# Altium project NIC Dataloger.PrjPcb
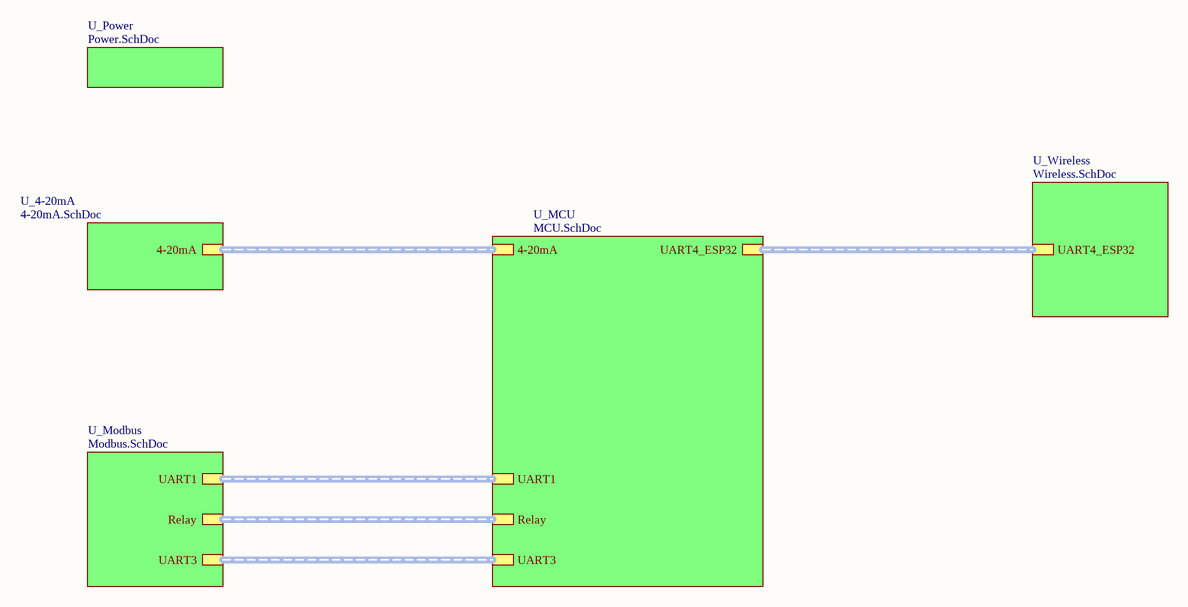
[diagram p0: Diagram.SchDoc]

6 sheets, 151 parts. Net scope: hierarchical (ports join the sheet entries above them; power ports are global).
Board file: Let's Connect.PcbDoc
Sheets:
  Diagram.SchDoc
    U_Modbus = Modbus.SchDoc
    U_Wireless = Wireless.SchDoc
    U_Power = Power.SchDoc
    U_MCU = MCU.SchDoc
    U_4-20mA = 4-20mA.SchDoc

## Sheet Diagram.SchDoc
size A4; SheetNumber: 1; SheetTotal: 8

### Sub-sheets
U_4-20mA = 4-20mA.SchDoc: 4-20mA (harness 4-20mA)
U_MCU = MCU.SchDoc: UART1 (harness UART1), UART3 (harness UART3), Relay (harness Relay), UART4_ESP32 (harness UART4_ESP32), 4-20mA (harness 4-20mA)
U_Modbus = Modbus.SchDoc: UART1 (harness UART1), UART3 (harness UART3), Relay (harness Relay)
U_Power = Power.SchDoc: no entries
U_Wireless = Wireless.SchDoc: UART4_ESP32 (harness UART4_ESP32)

### Buses and harness runs
harness sheet U_4-20mA/4-20mA = sheet U_MCU/4-20mA
harness sheet U_MCU/Relay = sheet U_Modbus/Relay
harness sheet U_MCU/UART1 = sheet U_Modbus/UART1
harness sheet U_MCU/UART3 = sheet U_Modbus/UART3
harness sheet U_MCU/UART4_ESP32 = sheet U_Wireless/UART4_ESP32

### Notes on the sheet
- Title
- Size:
- Date:
- A3
- Number:
- Time:
- Revision:
- Sheet
- of
- NICHIETSUVN.COM <http://NICHIETSUVN.COM>
- R&D
- File:

## Sheet Modbus.SchDoc
size A4; SheetNumber: 4; SheetTotal: 6
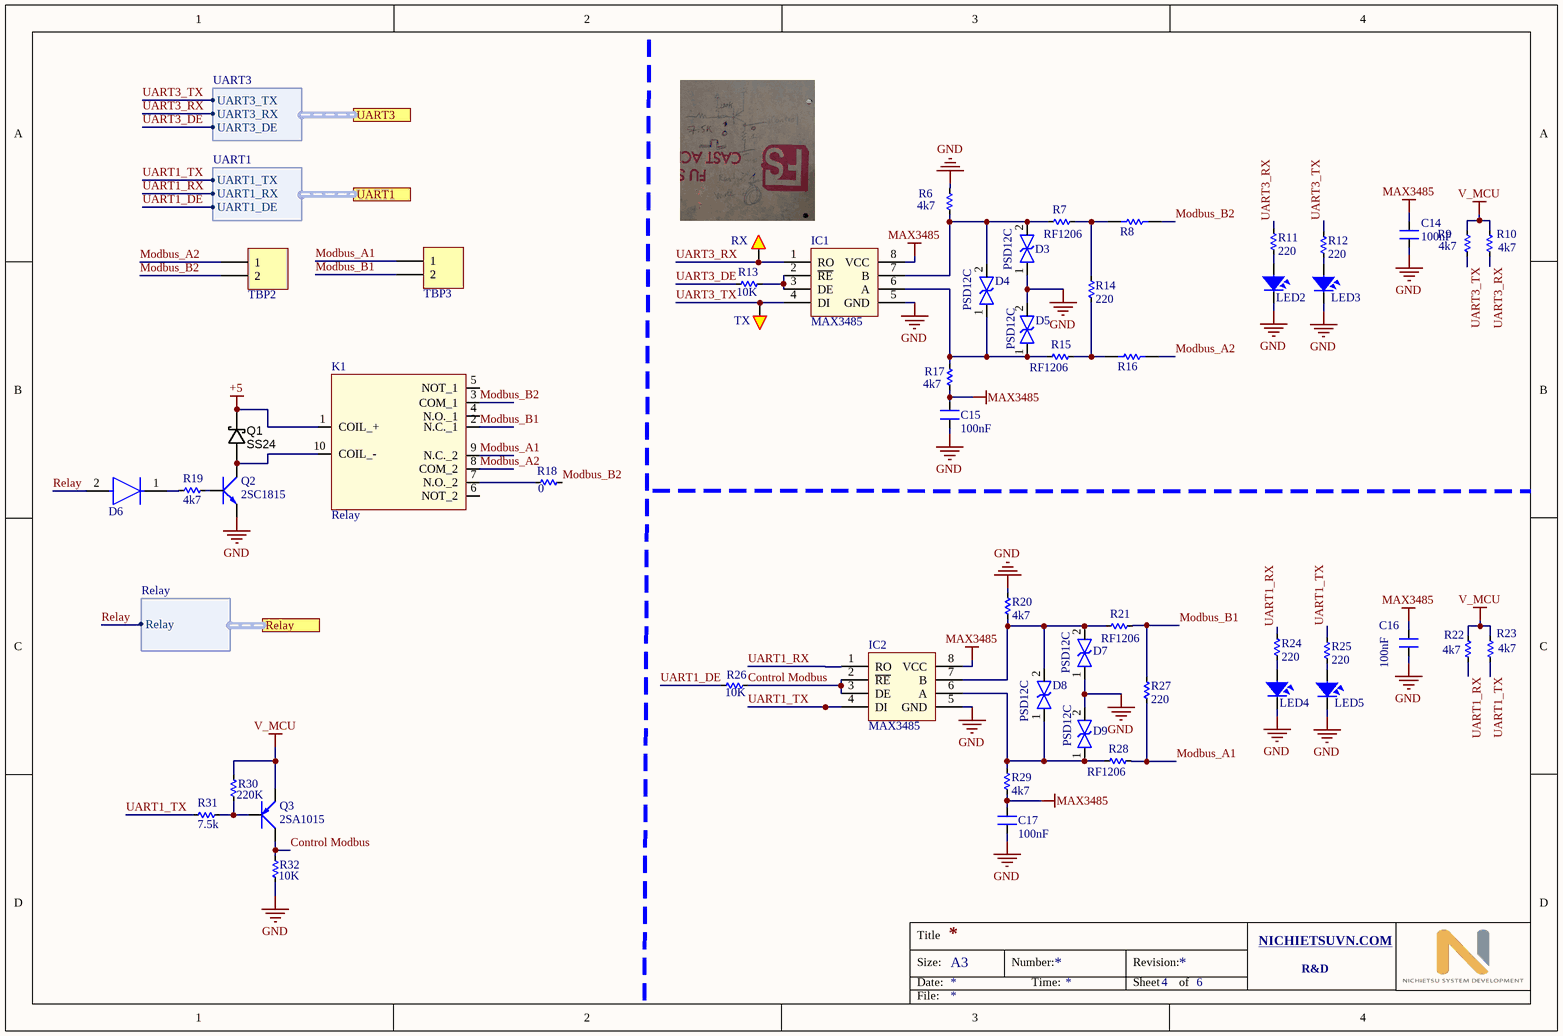
[diagram p1: Modbus.SchDoc]

### Parts
B1  RX  [SMD_1.5]
B2  TX  [SMD_1.5]
C14  100nF  [CN-SMD-0603]
C15  100nF  [CN-SMD-0603]
C16  100nF  [CN-SMD-0603]
C17  100nF  [CN-SMD-0603]
D3  PSD12C  [PSD12C]
D4  PSD12C  [PSD12C]
D5  PSD12C  [PSD12C]
D6  1N4148W-HE3-08  [1N4148]  (value not drawn)
D7  PSD12C  [PSD12C]
D8  PSD12C  [PSD12C]
D9  PSD12C  [PSD12C]
IC1  MAX3485  [SO8]
IC2  MAX3485  [SO8]
K1  Relay  [Relay EA2]
LED2  LED  [LED-0805-Blue]  (value not drawn)
LED3  LED  [LED-0805-Blue]  (value not drawn)
LED4  LED  [LED-0805-Blue]  (value not drawn)
LED5  LED  [LED-0805-Blue]  (value not drawn)
Q1  SS24  [DO-214AC]
Q2  2SC1815  [SOT23-321]
Q3  2SA1015  [SOT23-321]
R6  4k7  [RES-SMD-0603]
R7  RF1206  [RES-SMD-1206]
R8  0R/R0603  [R0603]  (value not drawn)
R9  4k7  [RES-SMD-0603]
R10  4k7  [RES-SMD-0603]
R11  220  [RES-SMD-0603]
R12  220  [RES-SMD-0603]
R13  10K  [RES-SMD-0603]
R14  220  [RES-SMD-0603]
R15  RF1206  [RES-SMD-1206]
R16  0R/R0603  [R0603]  (value not drawn)
R17  4k7  [RES-SMD-0603]
R18  0  [RES-SMD-0603]
R19  4k7  [RES-SMD-0603]
R20  4k7  [RES-SMD-0603]
R21  RF1206  [RES-SMD-1206]
R22  4k7  [RES-SMD-0603]
R23  4k7  [RES-SMD-0603]
R24  220  [RES-SMD-0603]
R25  220  [RES-SMD-0603]
R26  10K  [RES-SMD-0603]
R27  220  [RES-SMD-0603]
R28  RF1206  [RES-SMD-1206]
R29  4k7  [RES-SMD-0603]
R30  220K  [RES-SMD-0603]
R31  7.5k  [RES-SMD-0603]
R32  10K  [RES-SMD-0603]
TBP2  WE-Terminal Blocks Plugable Type 691322310002  [Terminal_Blocks_Pluggable_Socket__Right_Angle__3.81_mm_Pitch__2_Position]  (value not drawn)
TBP3  WE-Terminal Blocks Plugable Type 691322310002  [Terminal_Blocks_Pluggable_Socket__Right_Angle__3.81_mm_Pitch__2_Position]  (value not drawn)

### Ports
Relay (harness Relay), UART1 (harness UART1), UART3 (harness UART3)

### Harnesses
UART1: UART1_TX, UART1_RX, UART1_DE
UART3: UART3_TX, UART3_RX, UART3_DE
Relay: Relay

### Nets
+5: K1.1(COIL_+) Q1.C
GND: C14.1 C15.2 C16.1 C17.2 D3.1 D5.2 D7.1 D9.2 IC1.5(GND) IC2.5(GND) LED2.2 LED3.2 LED4.2 LED5.2 Q2.1(E) R6.1 R20.1 R32.1
MAX3485: C14.2 C15.1 C16.2 C17.1 IC1.8(VCC) IC2.8(VCC) R17.1 R29.1
V_MCU: Q3.1(E) R9.1 R10.1 R22.1 R23.1 R30.2
Control Modbus: IC2.2(~{RE}) IC2.3(DE) Q3.2(C) R26.2 R32.2
Modbus_A1: K1.9(N.C._2) R27.2 R28.1 TBP3.1
Modbus_A2: K1.8(COM_2) R16.2 TBP2.1
Modbus_B1: K1.2(N.C._1) R21.1 R27.1 TBP3.2
Modbus_B2: K1.3(COM_1) R8.2 R18.2 TBP2.2
Relay: D6.2(A) ; port Relay.Relay
UART1_DE: R26.1 ; port UART1.UART1_DE
UART1_RX: IC2.1(RO) R22.2 R24.1 ; port UART1.UART1_RX
UART1_TX: IC2.4(DI) R23.2 R25.1 R31.1 ; port UART1.UART1_TX
UART3_DE: R13.1 ; port UART3.UART3_DE
UART3_RX: B1.1 IC1.1(RO) R10.2 R11.1 ; port UART3.UART3_RX
UART3_TX: B2.1 IC1.4(DI) R9.2 R12.1 ; port UART3.UART3_TX
NetD3_2: D3.2 D4.2 IC1.7(B) R6.2 R7.2
NetD4_1: D4.1 D5.1 IC1.6(A) R15.2 R17.2
NetD6_1: D6.1(C) R19.2
NetD7_2: D7.2 D8.2 IC2.7(B) R20.2 R21.2
NetD8_1: D8.1 D9.1 IC2.6(A) R28.2 R29.2
NetIC1_2: IC1.2(~{RE}) IC1.3(DE) R13.2
NetK1_7: K1.7(N.O._2) R18.1
NetK1_10: K1.10(COIL_-) Q1.A Q2.2(C)
NetLED2_1: LED2.1 R11.2
NetLED3_1: LED3.1 R12.2
NetLED4_1: LED4.1 R24.2
NetLED5_1: LED5.1 R25.2
NetQ2_3: Q2.3(B) R19.1
NetQ3_3: Q3.3(B) R30.1 R31.2
NetR7_1: R7.1 R8.1 R14.1
NetR14_2: R14.2 R15.1 R16.1

Not connected (* = marked no-connect by the designer): K1 4(N.O._1) 5(NOT_1) 6(NOT_2)

### Notes on the sheet
- Title
- Size:
- Date:
- A3
- Number:
- Time:
- Revision:
- Sheet
- of
- NICHIETSUVN.COM <http://NICHIETSUVN.COM>
- R&D
- File:

### Library data of the parts
B1 B2 = Test: WR-PHD 2.54 mm Angled Socket Header; Manufacturer: W¨¹rth Elektronik eiSos GmbH; partNo: 613002143121; ComponentLink1 Description: Manufacturer; ComponentLink2 Description: Datasheet; NoPins: 02; Created Date: 29 March 2013; ComponentLink1URL: http://www.we-online.com; ComponentLink2URL: http://katalog.we-online.de/em/datasheet/6130xx143121.pdf; Created by: Karrer Zheng
C14-C17 = CN: Value: 33pF
D3-D5 D7-D9 = PSD12C: diode tvs
IC1 IC2 = MAX485: RS232 - RS485 (Same sn75176)
K1 = EA2-5NU: Relay or Contactor; Manufacturer_Name: Kemet; Datasheet Link: https://api.kemet.com/component-edge/download/datasheet/EA2-5NU.pdf; Height: 5.4mm; Manufacturer_Part_Number: EA2-5NU
LED2-LED5 = LED SMD: Value: LED 3 - 5 ly 2 Colour
Q1 = DIODE_SS24: Diode Schottky 40V 2A Surface Mount DO-214AC (SMA); Manufacturer 1: Comchip Technology; Manufacturer Part Number 1: SS24-HF; Speed: Fast Recovery =< 500ns, > 200mA (Io); Ratings: 40V; 2A; Pcs 2: 1; Parameter 1Voltage - Forward (Vf) (Max) @ If: 550mV @ 2A; Package / Case: DO-214AC, SMA; Diode Type: Schottky; Mounting Type: Surface Mount; Supplier 1: Digi-Key; Supplier Part Number 1: 641-SS24-HFDKR-ND; Supplier 2: https://www.thegioiic.com; Supplier Part Number 2: https://www.thegioiic.com/products/ss24-sma; Price 2: 800
Q2 = 2SC1815: NPN 600mW, ECB; Value: C1815
Q3 = 2SA1015: PNP 600mW, ECB; Value: A1015
R6 R7 R9-R15 R17-R32 = Res-SMD: Resistor; Manufacturer: Generic Components; Class: Passive; Published: 08/06/2000; Publisher: Altium Hobart Technology Centre
R8 R16 = RES_0R_R0603: RES SMD 0.0OHM JUMPER 1/10W 0603; Manufacturer: Yageo; Manufacturer Part Number: RC0603JR-070RL; Resistance (Ohms): 0.0; Power (Watts): 0.1W, 1/10W; RoHS: RoHS Compliant; Category: Resistors; Packaging: Tape & Reel (TR); Tolerance: Jumper; Composition: Thick Film; Features: Moisture Resistant; Temperature Coefficient: -; Operating Temperature: -55°C ~ 155°C; Package / Case: 0603 (1608 Metric); Supplier Device Package: 0603; Size / Dimension: 0.063" L x 0.031" W (1.60mm x 0.80mm); Height: 0.022" (0.55mm); Number of Terminations: 2; ComponentLink1URL: http://www.yageo.com/documents/recent/PYu-RC_Group_51_RoHS_L_04.pdf; ComponentLink1Description: http://www.yageo.com/documents/recent/PYu-RC_Group_51_RoHS_L_04.pdf; Supplier 1: Digi-Key; Supplier Part Number 1: 311-0.0GRCT-ND
TBP2 TBP3 = Terminal_Blocks_Pluggable_Socket__Right_Angle__3.81_mm_Pitch__2_Position: WR-TBL Terminal block - serie 322 - 3.81 mm; Manufacturer 1: W¨¹rth Elektronik eiSos GmbH; ComponentLink1 Description: Manufacturer; ComponentLink2 Description: Datasheet; NoPins: 02; Pcs 2: 1; ComponentLink1URL: http://www.we-online.com; ComponentLink2URL: http://katalog.we-online.de/em/datasheet/6913223100xx.pdf; Supplier 1: Digi-Key; Supplier Part Number 1: *; Supplier 2: https://www.thegioiic.com; Manufacturer Part Number 1: 691322310002; Supplier Part Number 2: https://www.thegioiic.com/products/kf-3-81-2-r-terminal-block-plug-in-han-pcb-2-chan-cong-3-81mm; Price 2: 2000

## Sheet Wireless.SchDoc
size A4; SheetNumber: 6; SheetTotal: 6
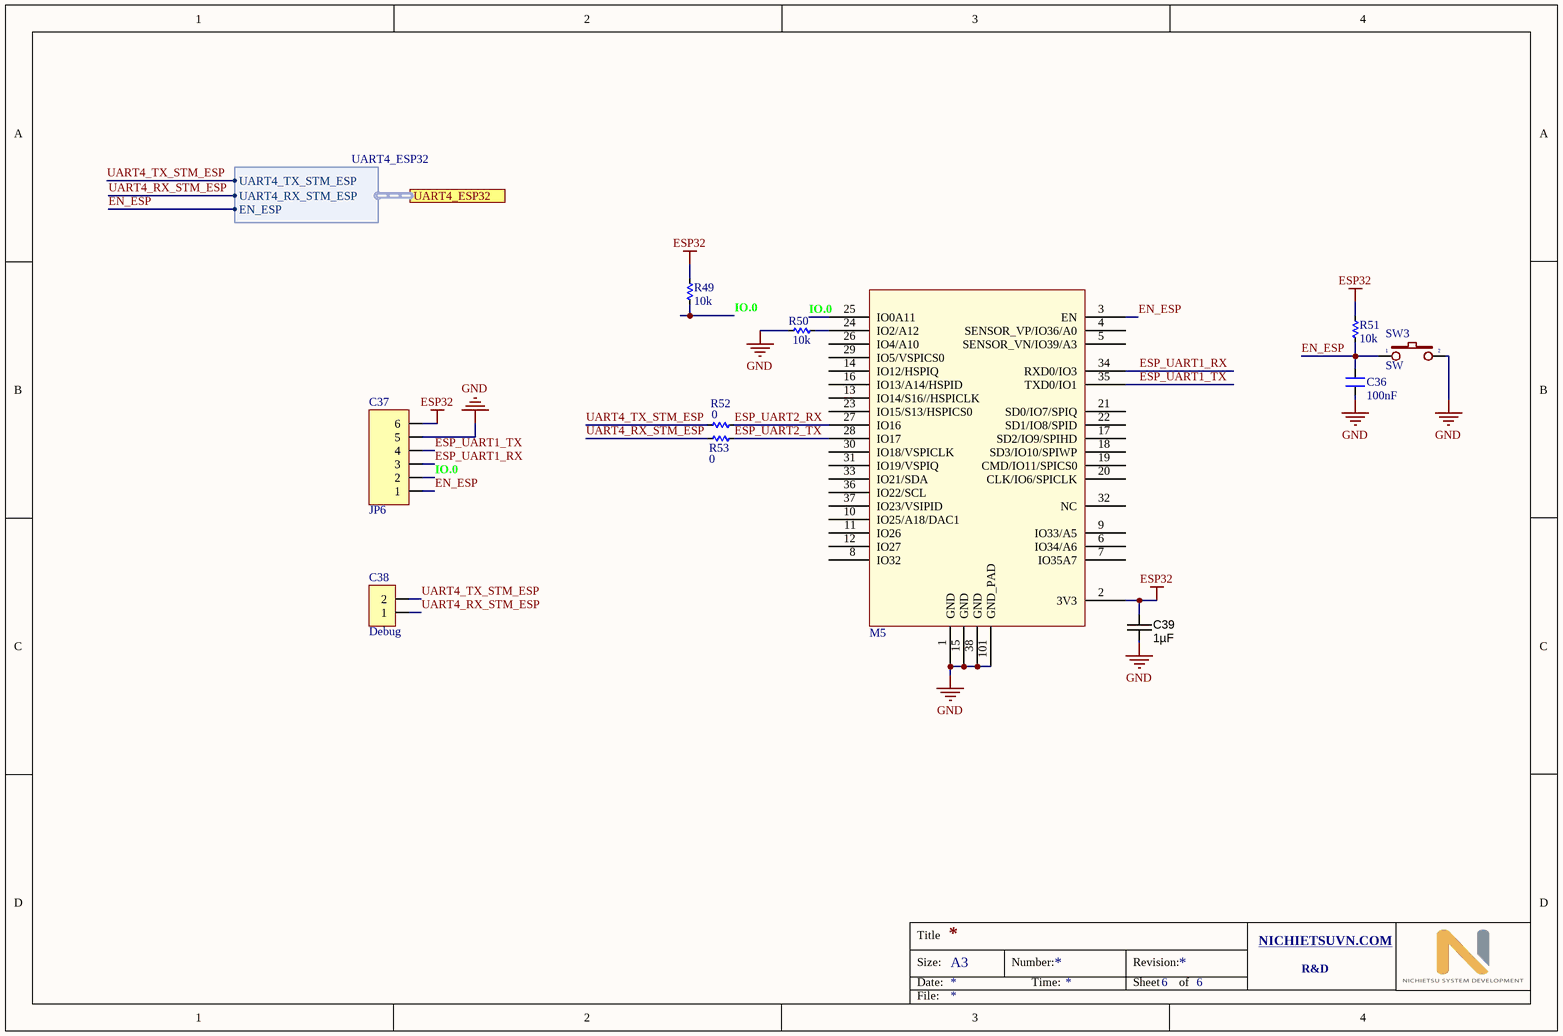
[diagram p2: Wireless.SchDoc]

### Parts
C36  100nF  [CN-SMD-0603]
C37  JP6  [JP6-D1T]
C38  Debug  [JP2-CLOSED]
C39  1µF  [CAPC1608X90N]
M5  ESP32S_Module  [ESP32S]  (value not drawn)
R49  10k  [RES-SMD-0603]
R50  10k  [RES-SMD-0603]
R51  10k  [RES-SMD-0603]
R52  0  [RES-SMD-0603]
R53  0  [RES-SMD-0603]
SW3  SW  [SW1-SMD]

### Ports
UART4_ESP32 (harness UART4_ESP32)

### Harnesses
UART4_ESP32: UART4_TX_STM_ESP, UART4_RX_STM_ESP, EN_ESP

### Nets
ESP32: C37.6 C39.1 M5.2(3V3) R49.1 R51.1
GND: C36.2 C37.5 C39.2 M5.1(GND) M5.15(GND) M5.38(GND) M5.101(GND_PAD) R50.1 SW3.2
EN_ESP: C36.1 C37.1 M5.3(EN) R51.2 SW3.1 ; port UART4_ESP32.EN_ESP
ESP_UART1_RX: C37.3 M5.34(RXD0/IO3)
ESP_UART1_TX: C37.4 M5.35(TXD0/IO1)
ESP_UART2_RX: M5.27(IO16) R52.1
ESP_UART2_TX: M5.28(IO17) R53.1
IO.0: C37.2 M5.25(IO0A11) R49.2
UART4_RX_STM_ESP: C38.1 R53.2 ; port UART4_ESP32.UART4_RX_STM_ESP
UART4_TX_STM_ESP: C38.2 R52.2 ; port UART4_ESP32.UART4_TX_STM_ESP
NetM5_24: M5.24(IO2/A12) R50.2

Not connected (* = marked no-connect by the designer): M5 4(SENSOR_VP/IO36/A0) 5(SENSOR_VN/IO39/A3) 6(IO34/A6) 7(IO35A7) 8(IO32) 9(IO33/A5) 10(IO25/A18/DAC1) 11(IO26) 12(IO27) 13(IO14/S16//HSPICLK) 14(IO12/HSPIQ) 16(IO13/A14/HSPID) 17(SD2/IO9/SPIHD) 18(SD3/IO10/SPIWP) 19(CMD/IO11/SPICS0) 20(CLK/IO6/SPICLK) 21(SD0/IO7/SPIQ) 22(SD1/IO8/SPID) 23(IO15/S13/HSPICS0) 26(IO4/A10) 29(IO5/VSPICS0) 30(IO18/VSPICLK) 31(IO19/VSPIQ) 32(NC) 33(IO21/SDA) 36(IO22/SCL) 37(IO23/VSIPID)

### Notes on the sheet
- Title
- Size:
- Date:
- A3
- Number:
- Time:
- Revision:
- Sheet
- of
- NICHIETSUVN.COM <http://NICHIETSUVN.COM>
- R&D
- File:

### Library data of the parts
C36 = CN: Value: 33pF
C37 = JP6: WR-PHD 2.54 mm Angled Socket Header; Manufacturer: W¨¹rth Elektronik eiSos GmbH; partNo: 613006143121; ComponentLink1 Description: Manufacturer; ComponentLink2 Description: Datasheet; NoPins: 06; Created Date: 29 March 2013; ComponentLink1URL: http://www.we-online.com; ComponentLink2URL: http://katalog.we-online.de/em/datasheet/6130xx143121.pdf; Created by: Karrer Zheng
C38 = JP2: WR-PHD 2.54 mm Angled Socket Header; Manufacturer: W¨¹rth Elektronik eiSos GmbH; partNo: 613002143121; ComponentLink1 Description: Manufacturer; ComponentLink2 Description: Datasheet; NoPins: 02; Created Date: 29 March 2013; ComponentLink1URL: http://www.we-online.com; ComponentLink2URL: http://katalog.we-online.de/em/datasheet/6130xx143121.pdf; Created by: Karrer Zheng
C39 = CAPC_1uF_0603_X7R_35V_10%: 1µF ±10% 16V Ceramic Capacitor X7R 0603 (1608 Metric); Manufacturer 1: Taiyo Yuden; Manufacturer Part Number 1: GMK107AB7105KAHT; Voltage - Rated: 35V; Pcs 2: 10; Tolerance: ±10%; Operating Temperature: -55°C ~ 125°C; Package / Case: 0603 (1608 Metric); Temperature Coefficient: X7R; Ratings: AEC-Q200; Applications: Automotive; Packaging: Digi-Reel®; Supplier 1: Digi-Key; Supplier Part Number 1: 587-3352-6-ND; Supplier 2: http://www.tme.vn; Supplier Part Number 2: http://www.tme.vn/Product.aspx?id=728#page=pro_info; Price 2: 1800; Value: 1µF
M5 = ESP32S_Module: Esp-32S; Datasheet: https://espressif.com/sites/default/files/documentation/esp_wroom_32_datasheet_en.pdf
R49-R53 = Res-SMD: as R6 on sheet Modbus; Published: 08/06/2000; Publisher: Altium Hobart Technology Centre
SW3 = SW2: Switch button 2 pin; Value: SW chip 2 pin

## Sheet Power.SchDoc
size A4; SheetNumber: 2; SheetTotal: 6
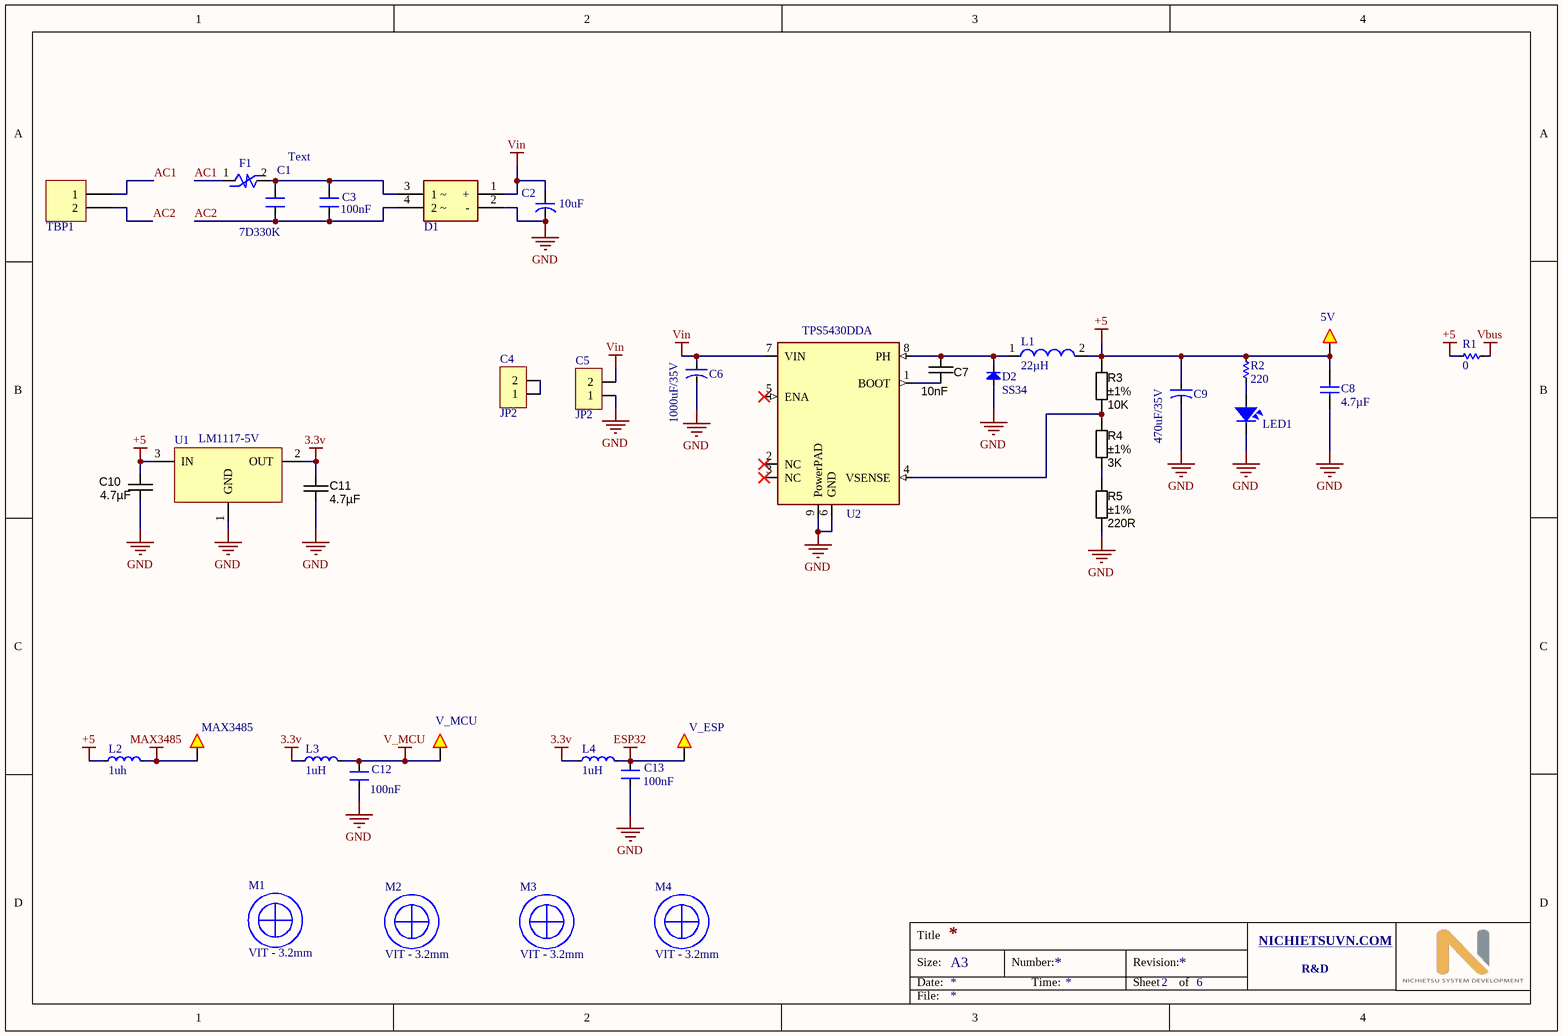
[diagram p3: Power.SchDoc]

### Parts
C1  7D330K  [CN2-G]
C2  10uF  [CN-SMD-0805]
C3  100nF  [CN1]
C4  JP2  [JP2-C1T]
C5  JP2  [JP2-C1T]
C6  1000uF/35V  [CA-ALU-5W]
C7  10nF  [CAPC1608X90N]
C8  4.7µF  [CAPC1608X06L]
C9  470uF/35V  [CA-ALU-5W]
C10  4.7µF  [CAPC2012X135N]
C11  4.7µF  [CAPC2012X135N]
C12  100nF  [CN-SMD-0603]
C13  100nF  [CN-SMD-0805]
Check1  5V  [SMD-2]
D1  MB6S  [MB6]  (value not drawn)
D2  SS34  [DIO-SMD-106]
F1  RUEF185  [RES-1WD]  (value not drawn)
L1  22µH  [IND_COIL_8D43]
L2  1uh  [INDC1608X06L]
L3  1uH  [INDC1608X06L]
L4  1uH  [INDC1608X06L]
LED1  LED  [LED-0805-Blue]  (value not drawn)
M1  VIT - 3.2mm  [VIT - 3.2MM_2]
M2  VIT - 3.2mm  [VIT - 3.2MM_2]
M3  VIT - 3.2mm  [VIT - 3.2MM_2]
M4  VIT - 3.2mm  [VIT - 3.2MM_2]
R1  0  [RES-SMD-0603]
R2  220  [RES-SMD-0603]
R3  value 10K  Tolerance: ±1%  [RESC1608X55N]  (hidden comment: 10K_0603_1%)
R4  value 3K  Tolerance: ±1%  [RESC1608X55N]  (hidden comment: 3K_0603_0.5%)
R5  value 220R  Tolerance: ±1%  [RESC1608X55N]  (hidden comment: 220R_0603_1%)
TBP1  WE-Terminal Blocks Plugable Type 691322310002  [Terminal_Blocks_Pluggable_Socket__Right_Angle__3.81_mm_Pitch__2_Position]  (value not drawn)
U1  LM1117-5V  [SOT223]
U2  TPS5430DDA  [TPS5430]
V1  MAX3485  [SMD_1]
V2  V_MCU  [SMD_1]
V3  V_ESP  [SMD_1]

### Nets
3.3v: C11.2 L3.1 L4.1 U1.2(OUT)
+5: C8.2 C9.1 C10.2 Check1.1 L1.2 L2.1 R1.1 R2.1 R3.2 U1.3(IN)
ESP32: C13.1 L4.2 V3.1
GND: C2.2 C5.1 C6.2 C8.1 C9.2 C10.1 C11.1 C12.1 C13.2 D1.2(-) D2.1(A) LED1.2 R5.1 U1.1(GND) U2.6(GND) U2.9(PowerPAD)
MAX3485: L2.2 V1.1
V_MCU: C12.2 L3.2 V2.1
Vbus: R1.2
Vin: C2.1 C5.2 C6.1 D1.1(+) U2.7(VIN)
AC1: F1.1 TBP1.1
AC2: C1.1 C3.2 D1.4(2_~) TBP1.2
NetC1_2: C1.2 C3.1 D1.3(1_~) F1.2
NetC4_1: C4.1 C4.2
NetC7_1: C7.1 U2.1(BOOT)
NetC7_2: C7.2 D2.2(K) L1.1 U2.8(PH)
NetLED1_1: LED1.1 R2.2
NetR3_1: R3.1 R4.2 U2.4(VSENSE)
NetR4_1: R4.1 R5.2

Not connected (* = marked no-connect by the designer): U2 2(NC)* 3(NC)* 5(ENA)*

### Notes on the sheet
- Text
- Title
- Size:
- Date:
- A3
- Number:
- Time:
- Revision:
- Sheet
- of
- NICHIETSUVN.COM <http://NICHIETSUVN.COM>
- R&D
- File:

### Library data of the parts
C1 C3 C12 C13 = CN: Value: 33pF
C2 = CAP_1: capacitor tantalum, pol
C4 C5 = JP2: as C38 on sheet Wireless; Created Date: 29 March 2013; ComponentLink1URL: http://www.we-online.com; ComponentLink2URL: http://katalog.we-online.de/em/datasheet/6130xx143121.pdf; Created by: Karrer Zheng
C6 C9 = CN-ALU-DIP: Capacitor (Semiconductor SIM Model); Value: 104; LatestRevisionDate: 17-Jul-2002; LatestRevisionNote: Re-released for DXP Platform.; PackageReference: C1206; Publisher: Altium Limited
C7 = CAPC_10000pF_0603_50V_10%: 10000pF ±10% 50V Ceramic Capacitor X7R 0603 (1608 Metric); Manufacturer 1: TDK Corporation; Manufacturer Part Number 1: CGA3E2X7R1H103K080AA; Pcs 2: 10; Tolerance: ±10%; Operating Temperature: -55°C ~ 125°C; Package / Case: 0603 (1608 Metric); Voltage - Rated: 50V; Ratings: AEC-Q200; Temperature Coefficient: X7R; Supplier Part Number 1: 445-5662-6-ND; Supplier 1: Digi-Key; Supplier 2: https://www.thegioiic.com; Supplier Part Number 2: https://www.thegioiic.com/products/tu-gom-0603-10nf-50v; Price 2: 1900; Value: 10nF
C8 = CAP_0603: Capacitor, X5R, ±10%; Part Number: C0603-4µ7; Note: 6.3V; Manufacturer: *; Manufacturer Part Number: *; LatestRevisionDate: 2009-11-23; Pin Count: 2; Publisher: Nordic Semiconductor; Published: 2009-05-08; Value: 4.7µF; Footprint Doc: 0603
C10 C11 = CAPC_4.7uF_0805_X7R_50V_10%: 4.7µF ±10% 50V Ceramic Capacitor X7R 0805 (2012 Metric); Manufacturer 1: TDK Corporation; Manufacturer Part Number: CGA4J1X7R1H475K125AE; Pcs 2: 1; Package / Case: 0805 (2012 metric); Tolerance: ±10%; Voltage - Rated: 50V; Temperature Coefficient: X7R; Ratings: AEC-Q200; Operating Temperature: -55°C ~ 125°C; Supplier 1: Digi-Key; Supplier Part Number 1: 445-181410-6-ND; Supplier 2: https://www.thegioiic.com; Supplier Part Number 2: https://www.thegioiic.com/products/tu-gom-0805-4-7uf-50v; Price 2: 680; Value: 4.7µF
Check1 V1-V3 = Test: as B1 on sheet Modbus; Created Date: 29 March 2013; ComponentLink1URL: http://www.we-online.com; ComponentLink2URL: http://katalog.we-online.de/em/datasheet/6130xx143121.pdf; Created by: Karrer Zheng
D2 = Diode SMD: Default Diode; Code - JEDEC: DO-214-AB; Value: 1N5007; Published: 8-Jun-2000; Revision: July-2002: Re-released for DXP Platform.; Publisher: Altium Limited
L1 = INDC_SMD_22uH_8D43: 22µH Shielded Wirewound Inductor 950mA 380mOhm Max Nonstandard; Manufacturer 1: Yageo; Current Rating (Amps): 3.25 A; Ratings: None AEC-Q200; Pcs 2: 1; Supplier 1: Digi-Key; Operating Temperature: -40°C ~ 125°C; Value: 22µH; Supplier 2: https://www.thegioiic.com/; Supplier Part Number 2: https://www.thegioiic.com/products/cuon-cam-dan-smd-8d43-220-22uh-3-25a; Price 2: 2000
L2-L4 = IND_0603: Chip inductor, IDC,min = 50 mA, ±20%; Part Number: L0603-10µ; Value: 10µH; LatestRevisionDate: 2012-09-19; Pin Count: 2; Publisher: Nordic Semiconductor; Published: 2010-02-24; Footprint Doc: 0603
LED1 = LED SMD: Value: LED 3 - 5 ly 2 Colour
R1 R2 = Res-SMD: as R6 on sheet Modbus; Published: 08/06/2000; Publisher: Altium Hobart Technology Centre
R3 = RES_10K_0603_1%: 10 kOhms ±1% 0.1W, 1/10W Chip Resistor 0603 (1608 Metric) Anti-Sulfur, Automotive AEC-Q200, Moisture Resistant Thin Film; Manufacturer: Stackpole Electronics Inc; Manufacturer Part Number: RMCF0603FT10K0; Temperature Coefficient: ±100ppm/°C; Pcs 2: 50; Package / Case: 0603 (1608 Metric); Power (Watts): 1/10W; Supplier 1: Digi-Key; Supplier Part Number 1: RMCF0603FT10K0DKR-ND; Ratings: Automotive AEC-Q200; Operating Temperature: -55°C ~ 155°C; Supplier 2: www.thegioiic.com; Supplier Part Number 2: https://www.thegioiic.com/products/dien-tro-10-kohm-0603-1; Price 2: 2000
R4 = RES_3K_0603_1%: 3 kOhms ±1% 0.1W, 1/10W Chip Resistor 0603 (1608 Metric) Automotive AEC-Q200 Thick Film; Manufacturer: Stackpole Electronics Inc; Manufacturer Part Number: RMCF0603FT3K00; Temperature Coefficient: ±100ppm/°C; Pcs 2: 50; Package / Case: 0603 (1608 Metric); Power (Watts): 1/10W; Supplier 1: Digi-Key; Supplier Part Number 1: RMCF0603FT3K00DKR-ND; Ratings: AEC-Q200; Supplier Part Number 2: https://www.thegioiic.com/products/dien-tro-3-kohm-0603-1; Supplier 2: www.thegioiic.com; Operating Temperature: -55°C ~ 155°C; Price 2: 2000
R5 = RES_220R_0603_1%: 220 Ohms ±1% 0.1W, 1/10W Chip Resistor 0603 (1608 Metric) Automotive AEC-Q200 Thick Film; Manufacturer: Stackpole Electronics Inc; Manufacturer Part Number: RMCF0603FT220R; Temperature Coefficient: ±100ppm/°C; Pcs 2: 50; Package / Case: 0603 (1608 Metric); Ratings: AEC-Q200; Supplier 1: Digi-Key; Supplier Part Number 1: RMCF0603FT220RDKR-ND; Power (Watts): 0.1W, 1/10W; Operating Temperature: -55°C ~ 155°C; Composition: Thick Film; Supplier 2: www.thegioiic.com; Supplier Part Number 2: https://www.thegioiic.com/products/dien-tro-220-ohm-0603-1; Price 2: 2000
TBP1 = Terminal_Blocks_Pluggable_Socket__Right_Angle__3.81_mm_Pitch__2_Position: as TBP2 on sheet Modbus; ComponentLink1URL: http://www.we-online.com; ComponentLink2URL: http://katalog.we-online.de/em/datasheet/6913223100xx.pdf; Supplier 1: Digi-Key; Supplier Part Number 1: *; Supplier 2: https://www.thegioiic.com; Manufacturer Part Number 1: 691322310002; Supplier Part Number 2: https://www.thegioiic.com/products/kf-3-81-2-r-terminal-block-plug-in-han-pcb-2-chan-cong-3-81mm; Price 2: 2000
U1 = LM1117: 800mA Low-Dropout Linear Regulator; Creator: Nguyen Ba Bien; Website: http://group3i.net

## Sheet MCU.SchDoc
size A4; SheetNumber: 3; SheetTotal: 6
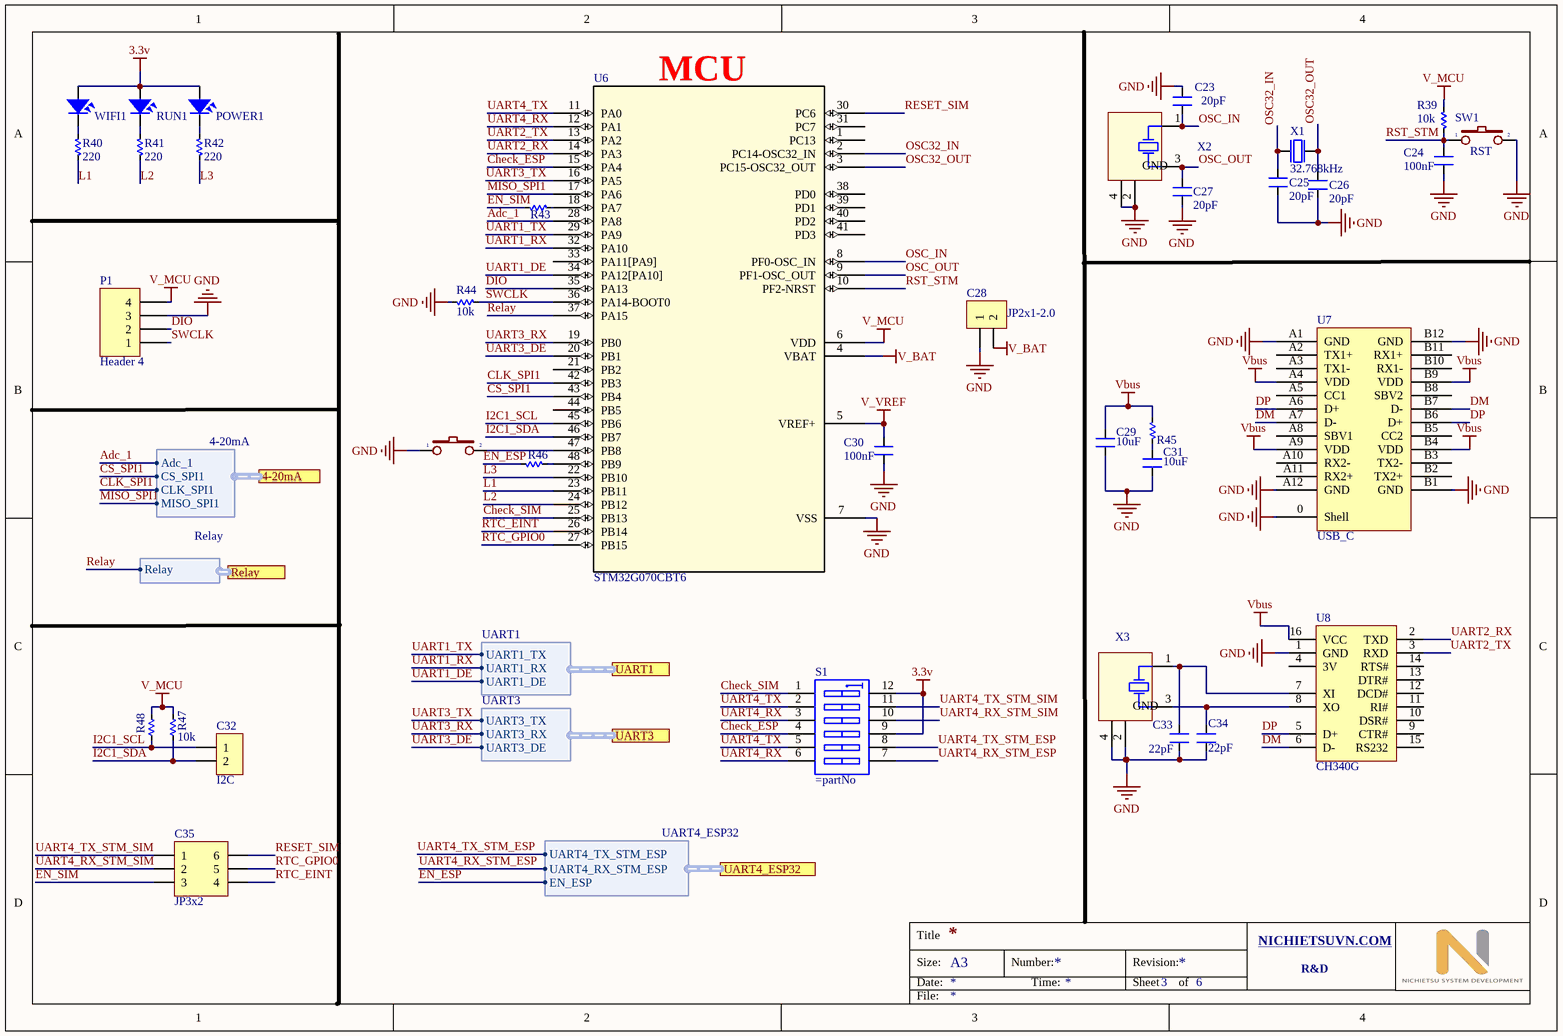
[diagram p4: MCU.SchDoc]

### Parts
C23  20pF  [CN-SMD-0603]
C24  100nF  [CN-SMD-0603]
C25  20pF  [CN-SMD-0603]
C26  20pF  [CN-SMD-0603]
C27  20pF  [CN-SMD-0603]
C28  JP2x1-2.0  [J2-C1T]
C29  10uF  [CN-SMD-0603]
C30  100nF  [CN-SMD-0603]
C31  10uF  [CN-SMD-0603]
C32  I2C  [J2-D1T]
C33  22pF  [CN-SMD-0603]
C34  22pF  [CN-SMD-0603]
C35  JP3x2  [JP3-C2T]
P1  Header 4  [Header 4]
POWER1  LED DO SMD  [LED-3MM-RED]  (value not drawn)
R39  10k  [RES-SMD-0603]
R40  220  [RES-SMD-0603]
R41  220  [RES-SMD-0603]
R42  220  [RES-SMD-0603]
R43  10k  [RES-SMD-0603]  (value not drawn)
R44  10k  [RES-SMD-0603]
R45  2R  [RES-SMD-0603]  (value not drawn)
R46  1K  [RES-SMD-0603]  (value not drawn)
R47  10k  [RES-SMD-0603]
R48  10k  [RES-SMD-0603]  (value not drawn)
RUN1  LED VANG SMD  [LED-3MM-BLUE]  (value not drawn)
S1  (no value)  [SW-DIP6]
SW1  RST  [SW1-SMD]
SW2  SW RESET  [SW1-DIP]  (value not drawn)
U6  STM32G070CBT6  [STM32G070CBT6]
U7  USB_C  [USB-Type_C_male]
U8  CH340G  [SO16]
WIFI1  LED XANH SMD  [LED-3MM-GREEN]  (value not drawn)
X1  32.768kHz  [XTAL_3215]
X2  XT4  [XT4-16.000MHz-4_V]  (value not drawn)
X3  XT4  [XT4-16.000MHz-4_V]  (value not drawn)

### Ports
4-20mA (harness 4-20mA), Relay (harness Relay), UART1 (harness UART1), UART3 (harness UART3), UART4_ESP32 (harness UART4_ESP32)

### Harnesses
UART1: UART1_TX, UART1_RX, UART1_DE
UART3: UART3_TX, UART3_RX, UART3_DE
Relay: Relay
UART4_ESP32: UART4_TX_STM_ESP, UART4_RX_STM_ESP, EN_ESP
4-20mA: Adc_1, CS_SPI1, CLK_SPI1, MISO_SPI1

### Nets
3.3v: POWER1.1 RUN1.1 S1.9 S1.12 WIFI1.1
GND: C23.2 C24.2 C25.1 C26.1 C27.1 C28.1 C29.1 C30.2 C31.1 C33.1 C34.1 P1.3 R44.2 SW1.2 SW2.1 U6.7(VSS) U7.0(Shell) U7.A1(GND) U7.A12(GND) U7.B1(GND) U7.B12(GND) U8.1(GND) X2.2(GND) X2.4(GND) X3.2(GND) X3.4(GND)
V_BAT: C28.2 U6.4(VBAT)
V_MCU: P1.4 R39.1 R47.2 R48.2 U6.6(VDD)
V_VREF: C30.1 U6.5(VREF+)
Vbus: C29.2 R45.2 U7.A4(VDD) U7.A9(VDD) U7.B4(VDD) U7.B9(VDD) U8.16(VCC)
Adc_1: U6.28(PA8) ; port 4-20mA.Adc_1
Check_ESP: S1.4 U6.15(PA4)
Check_SIM: S1.1 U6.25(PB13)
CLK_SPI1: U6.42(PB3) ; port 4-20mA.CLK_SPI1
CS_SPI1: U6.43(PB4) ; port 4-20mA.CS_SPI1
DIO: P1.2 U6.35(PA13)
DM: U7.A7(D-) U7.B7(D-) U8.6(D-)
DP: U7.A6(D+) U7.B6(D+) U8.5(D+)
EN_ESP: R46.2 ; port UART4_ESP32.EN_ESP
EN_SIM: C35.3 R43.2
I2C1_SCL: C32.1 R48.1 U6.45(PB6)
I2C1_SDA: C32.2 R47.1 U6.46(PB7)
L1: R40.2 U6.23(PB11)
L2: R41.2 U6.24(PB12)
L3: R42.2 U6.22(PB10)
MISO_SPI1: U6.17(PA6) ; port 4-20mA.MISO_SPI1
OSC32_IN: C25.2 U6.2(PC14-OSC32_IN) X1.2(out)
OSC32_OUT: C26.2 U6.3(PC15-OSC32_OUT) X1.1(inp)
OSC_IN: C23.1 U6.8(PF0-OSC_IN) X2.1(XTAL)
OSC_OUT: C27.2 U6.9(PF1-OSC_OUT) X2.3(XTAL)
Relay: U6.37(PA15) ; port Relay.Relay
RESET_SIM: C35.6 U6.30(PC6)
RST_STM: C24.1 R39.2 SW1.1 U6.10(PF2-NRST)
RTC_EINT: C35.4 U6.26(PB14)
RTC_GPIO0: C35.5 U6.27(PB15)
SWCLK: P1.1 R44.1 U6.36(PA14-BOOT0)
UART1_DE: U6.34(PA12[PA10]) ; port UART1.UART1_DE
UART1_RX: U6.32(PA10) ; port UART1.UART1_RX
UART1_TX: U6.29(PA9) ; port UART1.UART1_TX
UART2_RX: U6.14(PA3) U8.2(TXD)
UART2_TX: U6.13(PA2) U8.3(RXD)
UART3_DE: U6.20(PB1) ; port UART3.UART3_DE
UART3_RX: U6.19(PB0) ; port UART3.UART3_RX
UART3_TX: U6.16(PA5) ; port UART3.UART3_TX
UART4_RX: S1.3 S1.6 U6.12(PA1)
UART4_RX_STM_ESP: S1.7 ; port UART4_ESP32.UART4_RX_STM_ESP
UART4_RX_STM_SIM: C35.2 S1.10
UART4_TX: S1.2 S1.5 U6.11(PA0)
UART4_TX_STM_ESP: S1.8 ; port UART4_ESP32.UART4_TX_STM_ESP
UART4_TX_STM_SIM: C35.1 S1.11
NetC31_2: C31.2 R45.1
NetC33_2: C33.2 U8.7(XI) X3.1(XTAL)
NetC34_2: C34.2 U8.8(XO) X3.3(XTAL)
NetPOWER1_2: POWER1.2 R42.1
NetR40_1: R40.1 WIFI1.2
NetR41_1: R41.1 RUN1.2
NetR43_1: R43.1 U6.18(PA7)
NetR46_1: R46.1 U6.48(PB9)
NetSW2_2: SW2.2 U6.47(PB8)

Not connected (* = marked no-connect by the designer): U6 1(PC13) 21(PB2) 31(PC7) 33(PA11[PA9]) 38(PD0) 39(PD1) 40(PD2) 41(PD3) 44(PB5); U7 A2(TX1+) A3(TX1-) A5(CC1) A8(SBV1) A10(RX2-) A11(RX2+) B2(TX2+) B3(TX2-) B5(CC2) B8(SBV2) B10(RX1-) B11(RX1+); U8 4(3V) 9(CTR#) 10(DSR#) 11(RI#) 12(DCD#) 13(DTR#) 14(RTS#) 15(RS232)

### Notes on the sheet
- (near U6) MCU
- Title
- Size:
- Date:
- A3
- Number:
- Time:
- Revision:
- Sheet
- of
- NICHIETSUVN.COM <http://NICHIETSUVN.COM>
- R&D
- File:

### Library data of the parts
C23-C27 C29-C31 C33 C34 = CN: Value: 33pF
C28 C32 = JP2x1-2.0: WR-PHD 2.00 mm Socket Header; Manufacturer: W¨¹rth Elektronik eiSos GmbH; partNo: 62000211821; ComponentLink1 Description: Manufacturer; ComponentLink2 Description: Datasheet; NoPins: 02; Created Date: 2 April 2013; ComponentLink1URL: http://www.we-online.com; ComponentLink2URL: http://katalog.we-online.de/em/datasheet/6200xx11821.pdf; Created by: Karrer Zheng
C35 = JP3x2: WR-PHD 2.54 mm Dual Socket Header; Manufacturer: W¨¹rth Elektronik eiSos GmbH; partNo: 61300621821; ComponentLink1 Description: Manufacturer; ComponentLink2 Description: Datasheet; NoPins: 06; Created Date: 29 March 2013; ComponentLink1URL: http://www.we-online.com; ComponentLink2URL: http://katalog.we-online.de/em/datasheet/6130xx21821.pdf; Created by: Karrer Zheng
P1 = Header 4: Header, 4-Pin; LatestRevisionDate: 17-Jul-2002; LatestRevisionNote: Re-released for DXP Platform.; Publisher: Altium Limited
POWER1 RUN1 WIFI1 = LED: LED Single colour Green and Red; Value: LED 3 ly Single Colour
R39-R48 = Res-SMD: as R6 on sheet Modbus; Published: 08/06/2000; Publisher: Altium Hobart Technology Centre
S1 = SWDIP6: WS-DITV 2.54 mm small compact THT flat actuator with top tape; Manufacturer: Wurth Elektronik; Part No.: 418127160906; ComponentLink1 Description: Manufacturer; ComponentLink2 Description: Datasheet; Pole: 06; Created Date: Dec.2015; ComponentLink1URL: http://www.we-online.com; ComponentLink2URL: http://katalog.we-online.de/em/datasheet/4181271609xx.pdf; Created by: Baojun Chen
SW1 SW2 = SW2: as SW3 on sheet Wireless
U6 = STM32G070CBT6: No Description Available; Vendor: STMicroelectronics; Built_By: EMA_UL_Team; SourceLibrary: Updates_to_database_2020-10-19; Manufacturer_Part_Number: STM32G070CBT6; Copyright: Copyright (C) 2018 Accelerated Designs. All rights reserved; RefDes: RefDes; Type: DEV
U8 = CH340G: High and Low Side Driver; Note: Pins 4, 8 and 14 are not connected; Published: 8-Jun-2000; LatestRevisionDate: 04-Mar-2005; LatestRevisionNote: Stylized 3D Model Added.; DatasheetVersion: PD60147J; PackageReference: PDIP14; Publisher: Altium Limited; PackageDescription: DIP; 14 Leads; Row Spacing 7.62 mm; Pitch 2.54 mm; ComponentLink1Description: Manufacturer Link; ComponentLink1URL: http://www.irf.com/; ComponentLink2Description: Datasheet; ComponentLink2URL: http://www.irf.com/product-info/datasheets/data/ir2110.pdf
X1 = XTAL_SMD3215: XTAL SMD 3215, 32.768kHz, Cl=9pF, Total Tol: ±50ppm; Part Number: XTAL_SMD3215_32.768kHz_9pF_General; Manufacturer: *; Manufacturer Part Number: *; LatestRevisionDate: 2016-08-19; Pin Count: 2; Publisher: Nordic Semiconductor; Published: 2016-08-19; Value: 32.768kHz; Footprint Doc: XTAL_3215
X2 X3 = XT4: Crystal, 16 MHz, -30 to 85 degC, 3.2 x 2.5 x 0.9 mm SMD; Value: 4Mhz
U7 = USB_C: ComponentLink1Description: Mouser; ComponentLink1URL: https://www.mouser.vn/ProductDetail/Molex/217179-0001?qs=%2Fha2pyFadujPZQwqJ4qpNy59rfbPKcIakI7RjWJ8vsrvMLBBzEB8wQ%3D%3D

## Sheet 4-20mA.SchDoc
size A4; SheetNumber: 5; SheetTotal: 6
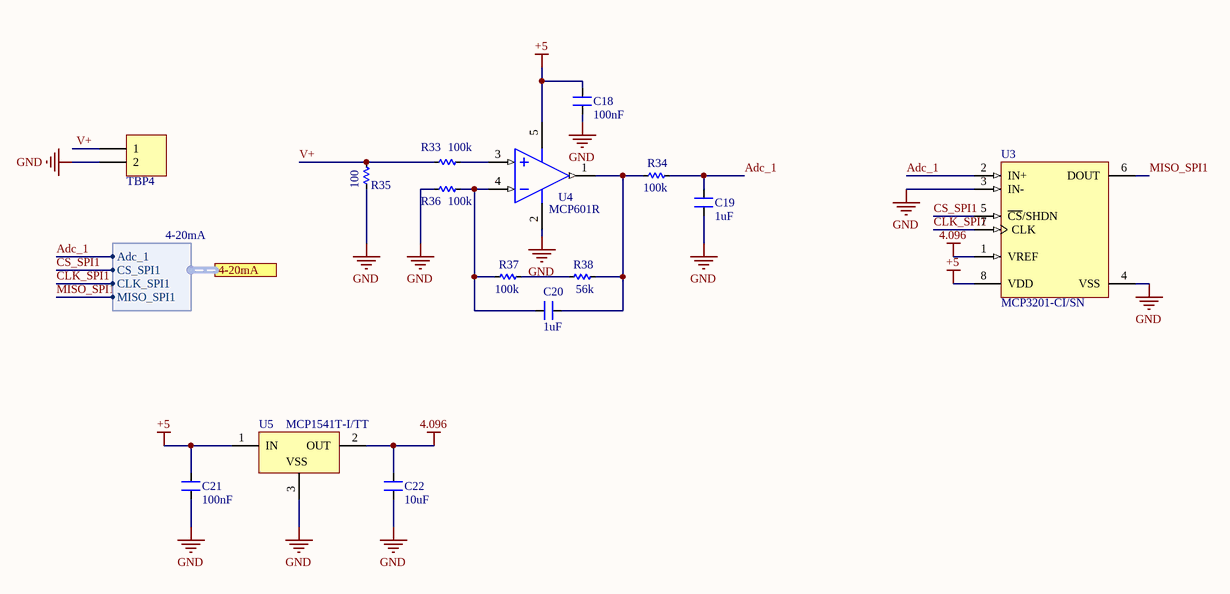
[diagram p5: 4-20mA.SchDoc]

### Parts
C18  100nF  [CN-SMD-0603]
C19  1uF  [CN-SMD-0603]
C20  1uF  [CN-SMD-0603]
C21  100nF  [CN-SMD-0603]
C22  10uF  [CN-SMD-0805]
R33  100k  [RES-SMD-0603]
R34  100k  [RES-SMD-0603]
R35  100  [RES-SMD-0603]
R36  100k  [RES-SMD-0603]
R37  100k  [RES-SMD-0603]
R38  56k  [RES-SMD-0603]
TBP4  WE-Terminal Blocks Plugable Type 691322310002  [Terminal_Blocks_Pluggable_Socket__Right_Angle__3.81_mm_Pitch__2_Position]  (value not drawn)
U3  MCP3201-CI/SN  [MCP3201]
U4  MCP601R  [MCP601]
U5  MCP1541T-I/TT  [MCP1541]

### Ports
4-20mA (harness 4-20mA)

### Harnesses
4-20mA: Adc_1, CS_SPI1, CLK_SPI1, MISO_SPI1

### Nets
4.096: C22.1 U3.1(VREF) U5.2(OUT)
+5: C18.2 C21.1 U3.8(VDD) U4.5(VSS) U5.1(IN)
GND: C18.1 C19.2 C21.2 C22.2 R35.2 R36.2 TBP4.2 U3.3(IN-) U3.4(VSS) U4.2(VDD) U5.3(VSS)
Adc_1: C19.1 R34.1 U3.2(IN+) ; port 4-20mA.Adc_1
CLK_SPI1: U3.7(CLK) ; port 4-20mA.CLK_SPI1
CS_SPI1: U3.5(~{CS}/SHDN) ; port 4-20mA.CS_SPI1
MISO_SPI1: U3.6(DOUT) ; port 4-20mA.MISO_SPI1
V+: R33.2 R35.1 TBP4.1
NetC20_1: C20.1 R34.2 R38.1 U4.1(VOUT)
NetC20_2: C20.2 R36.1 R37.2 U4.4(VIN-)
NetR33_1: R33.1 U4.3(VIN+)
NetR37_1: R37.1 R38.2

### Notes on the sheet
- Title
- Size:
- Date:
- A3
- Number:
- Time:
- Revision:
- Sheet
- of
- NICHIETSUVN.COM <http://NICHIETSUVN.COM>
- R&D
- File:

### Library data of the parts
C18-C22 = CN: Value: 33pF
R33-R38 = Res-SMD: as R6 on sheet Modbus; Published: 08/06/2000; Publisher: Altium Hobart Technology Centre
TBP4 = Terminal_Blocks_Pluggable_Socket__Right_Angle__3.81_mm_Pitch__2_Position: as TBP2 on sheet Modbus; ComponentLink1URL: http://www.we-online.com; ComponentLink2URL: http://katalog.we-online.de/em/datasheet/6913223100xx.pdf; Supplier 1: Digi-Key; Supplier Part Number 1: *; Supplier 2: https://www.thegioiic.com; Manufacturer Part Number 1: 691322310002; Supplier Part Number 2: https://www.thegioiic.com/products/kf-3-81-2-r-terminal-block-plug-in-han-pcb-2-chan-cong-3-81mm; Price 2: 2000
U3 = MCP3201-CI/SN: 2.7V 12-Bit A/D Converter with SPI Serial Interface, 8-Pin SOIC 150mil, C Performance Grade, Industrial Temperature; DatasheetVersion: revE, Dec-2008; Code_JEDEC: MS-012; Code_IPC: SOIC127P600-8; PackageVersion: revBB, Aug-2009; PackageDescription: 8-Lead Plastic Small Outline (SN) - Narrow, 3.90mm Body [SOIC]; PackageReference: SOIC-SN8; PartNumber: MCP3201-CI/SN
U4 = MCP601RT-I/OT: 2.7V to 6.0V Single Supply CMOS Operational Amplifier, 5-Pin SOT-23, Industrial Temperature, Tape and Reel; ComponentLink1Description: Manufacturer URL; ComponentLink2Description: Datasheet; DatasheetVersion: revG, Dec-2007; ComponentLink3URL: http://www.microchip.com/stellent/groups/techpub_sg/documents/packagingspec/en012702.pdf; ComponentLink3Description: Package Specification; ComponentLink1URL: http://www.microchip.com/; RevisionNote: URLs added.; Code_IPC: SOT23-5; PackageVersion: revBB, Aug-2009; PackageDescription: 5-Lead Plastic Small Outline Transistor (OT) [SOT-23]; ComponentLink2URL: http://ww1.microchip.com/downloads/en/DeviceDoc/21314g.pdf; PackageReference: SOT-23-OT5; PartNumber: MCP601RT-I/OT
U5 = MCP1541T-I/TT: 4.096V Voltage Reference, 3-Pin SOT-23, Industrial Temperature, Tape and Reel; Code_IPC: SOT23-3; PackageVersion: revBB, Aug-2009; DatasheetVersion: revB, Feb-2005; PackageDescription: 3-Lead Plastic Small Outline Transistor (TT) [SOT-23]; PackageReference: SOT-23-TT3; PartNumber: MCP1541T-I/TT

## Nets that join several sheets
3.3v: Power (C11.2 L3.1 L4.1 U1.2), MCU (5 pins)
+5: Modbus (K1.1 Q1.C), Power (10 pins), 4-20mA (5 pins)
ESP32: Wireless (5 pins), Power (C13.1 L4.2 V3.1)
GND: Modbus (18 pins), Wireless (9 pins), Power (16 pins), MCU (26 pins), 4-20mA (11 pins)
MAX3485: Modbus (8 pins), Power (L2.2 V1.1)
V_MCU: Modbus (6 pins), Power (C12.2 L3.2 V2.1), MCU (5 pins)
Vbus: Power (R1.2), MCU (7 pins)
Adc_1: MCU (U6.28), 4-20mA (C19.1 R34.1 U3.2)
CLK_SPI1: MCU (U6.42), 4-20mA (U3.7)
CS_SPI1: MCU (U6.43), 4-20mA (U3.5)
EN_ESP: Wireless (5 pins), MCU (R46.2)
MISO_SPI1: MCU (U6.17), 4-20mA (U3.6)
Relay: Modbus (D6.2), MCU (U6.37)
UART1_DE: Modbus (R26.1), MCU (U6.34)
UART1_RX: Modbus (IC2.1 R22.2 R24.1), MCU (U6.32)
UART1_TX: Modbus (IC2.4 R23.2 R25.1 R31.1), MCU (U6.29)
UART3_DE: Modbus (R13.1), MCU (U6.20)
UART3_RX: Modbus (B1.1 IC1.1 R10.2 R11.1), MCU (U6.19)
UART3_TX: Modbus (B2.1 IC1.4 R9.2 R12.1), MCU (U6.16)
UART4_RX_STM_ESP: Wireless (C38.1 R53.2), MCU (S1.7)
UART4_TX_STM_ESP: Wireless (C38.2 R52.2), MCU (S1.8)